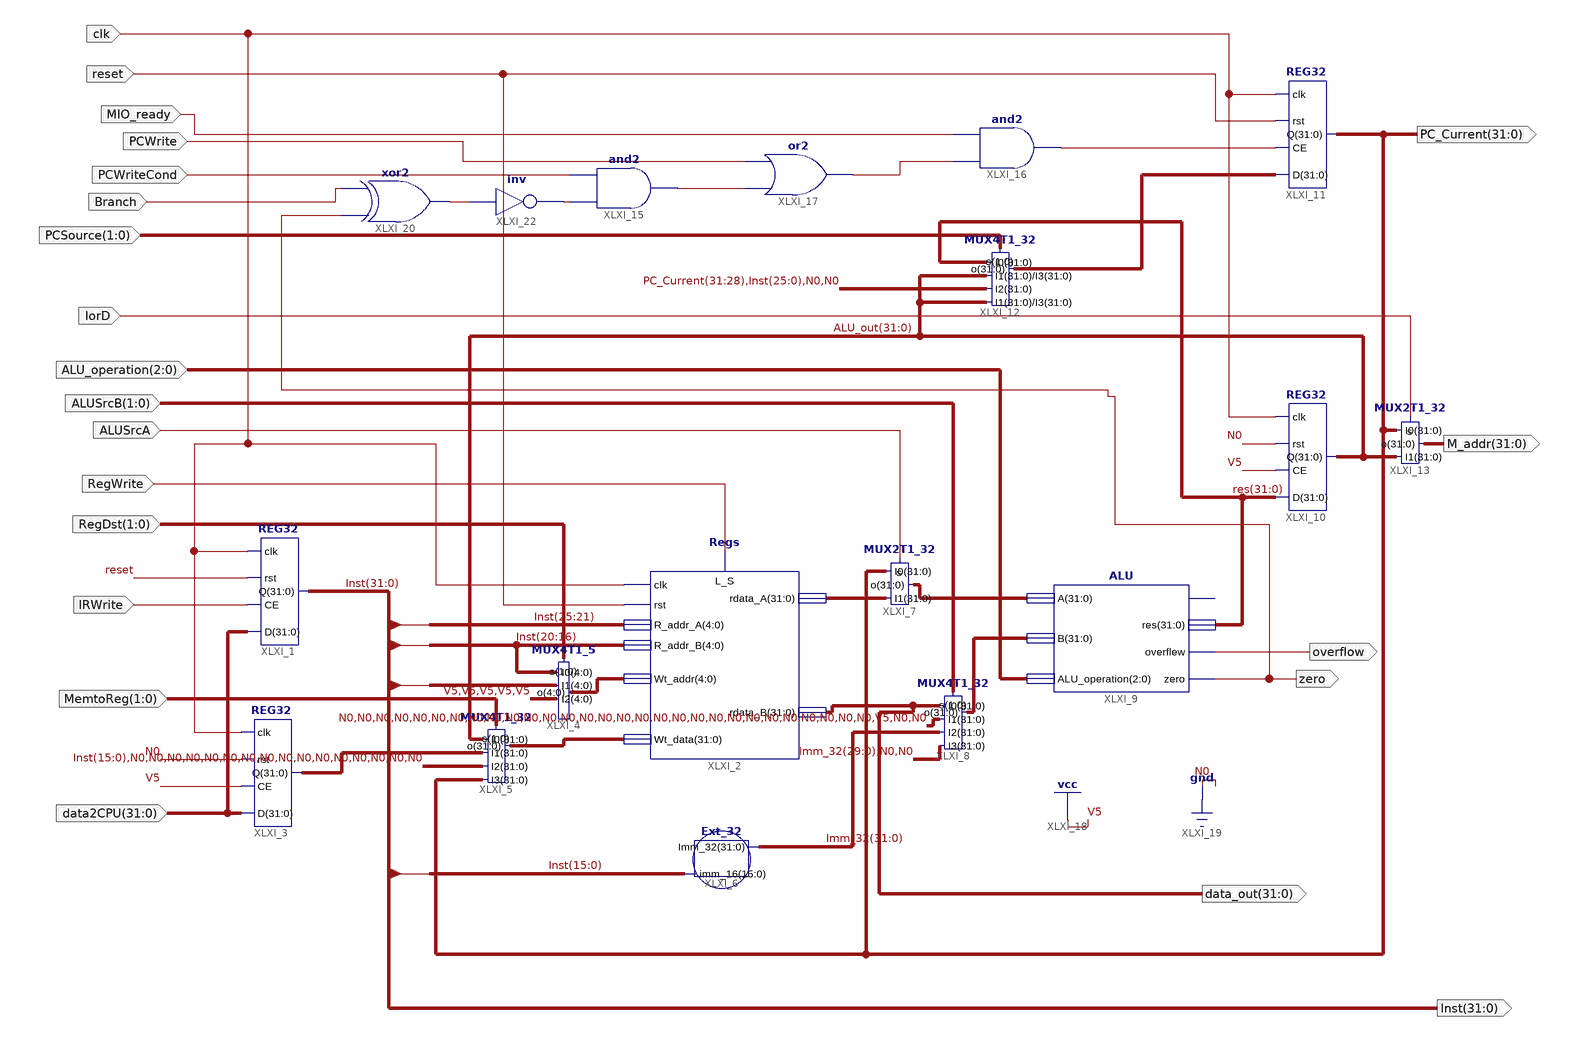
[diagram p0: schematic sheet 1]
// Xilinx ISE schematic MDPath.sch (kintex7) as structural Verilog: 18 symbols, 22 ports
module MDPath (
  input  IRWrite,
  input  reset,
  input  [31:0] data2CPU,
  input  clk,
  input  [1:0] MemtoReg,
  input  [1:0] RegDst,
  input  RegWrite,
  input  ALUSrcA,
  input  [1:0] ALUSrcB,
  input  [2:0] ALU_operation,
  input  IorD,
  input  [1:0] PCSource,
  input  Branch,
  input  PCWriteCond,
  input  PCWrite,
  input  MIO_ready,
  output [31:0] Inst,
  output [31:0] data_out,
  output [31:0] M_addr,
  output [31:0] PC_Current,
  output overflow,
  output zero
);

  wire XLXN_78, XLXN_84, XLXN_85, XLXN_86, XLXN_87;
  wire [4:0] XLXN_19;
  wire [31:0] ALU_out, Imm_32, res, XLXN_22, XLXN_23, XLXN_35, XLXN_38, XLXN_39, XLXN_81;

  REG32 XLXI_1 (.D(data2CPU), .CE(IRWrite), .rst(reset), .clk(clk), .Q(Inst));
  Regs XLXI_2 (
    .clk(clk), .L_S(RegWrite), .rdata_A(XLXN_35), .rst(reset), .Wt_data(XLXN_22), .rdata_B(data_out),
    .R_addr_A(Inst[25:21]), .R_addr_B(Inst[20:16]), .Wt_addr(XLXN_19));
  REG32 XLXI_3 (.D(data2CPU), .CE(1'b1), .rst(1'b0), .clk(clk), .Q(XLXN_23));
  MUX4T1_5 XLXI_4 (.s(RegDst), .I1(Inst[15:11]), .I0(Inst[20:16]), .o(XLXN_19), .I2({5{1'b1}}));  // open: I3
  MUX4T1_32 XLXI_5 (
    .s(MemtoReg), .I0(ALU_out), .I1(XLXN_23), .I2({Inst[15:0], {16{1'b0}}}), .I3(PC_Current), .o(XLXN_22));
  Ext_32 XLXI_6 (.imm_16(Inst[15:0]), .Imm_32(Imm_32));
  MUX2T1_32 XLXI_7 (.s(ALUSrcA), .I0(PC_Current), .I1(XLXN_35), .o(XLXN_38));
  MUX4T1_32 XLXI_8 (
    .s(ALUSrcB), .I0(data_out), .I1(32'b00000000000000000000000000000100), .I2(Imm_32),
    .I3({Imm_32[29:0], 2'b00}), .o(XLXN_39));
  ALU XLXI_9 (
    .A(XLXN_38), .B(XLXN_39), .ALU_operation(ALU_operation), .res(res), .overflew(overflow), .zero(zero));  // open: Co
  REG32 XLXI_10 (.D(res), .CE(1'b1), .rst(1'b0), .clk(clk), .Q(ALU_out));
  REG32 XLXI_11 (.D(XLXN_81), .CE(XLXN_78), .rst(reset), .clk(clk), .Q(PC_Current));
  MUX4T1_32 XLXI_12 (
    .s(PCSource), .I0(res), .I1(ALU_out), .I2({PC_Current[31:28], Inst[25:0], 2'b00}), .I3(ALU_out),
    .o(XLXN_81));
  MUX2T1_32 XLXI_13 (.s(IorD), .I0(PC_Current), .I1(ALU_out), .o(M_addr));
  and XLXI_15 (XLXN_85, XLXN_86, PCWriteCond);
  and XLXI_16 (XLXN_78, XLXN_84, MIO_ready);
  or XLXI_17 (XLXN_84, XLXN_85, PCWrite);
  xor XLXI_20 (XLXN_87, zero, Branch);
  not XLXI_22 (XLXN_86, XLXN_87);
endmodule
